# Altium schematic sheet Motors-Encoders.SchDoc
size A4; Organization: Memristor-Robotics; Address1: Vladimira Perića Valtera; Address2: Novi Sad, 21000; Address3: Serbia; SheetNumber: 9; SheetTotal: 11
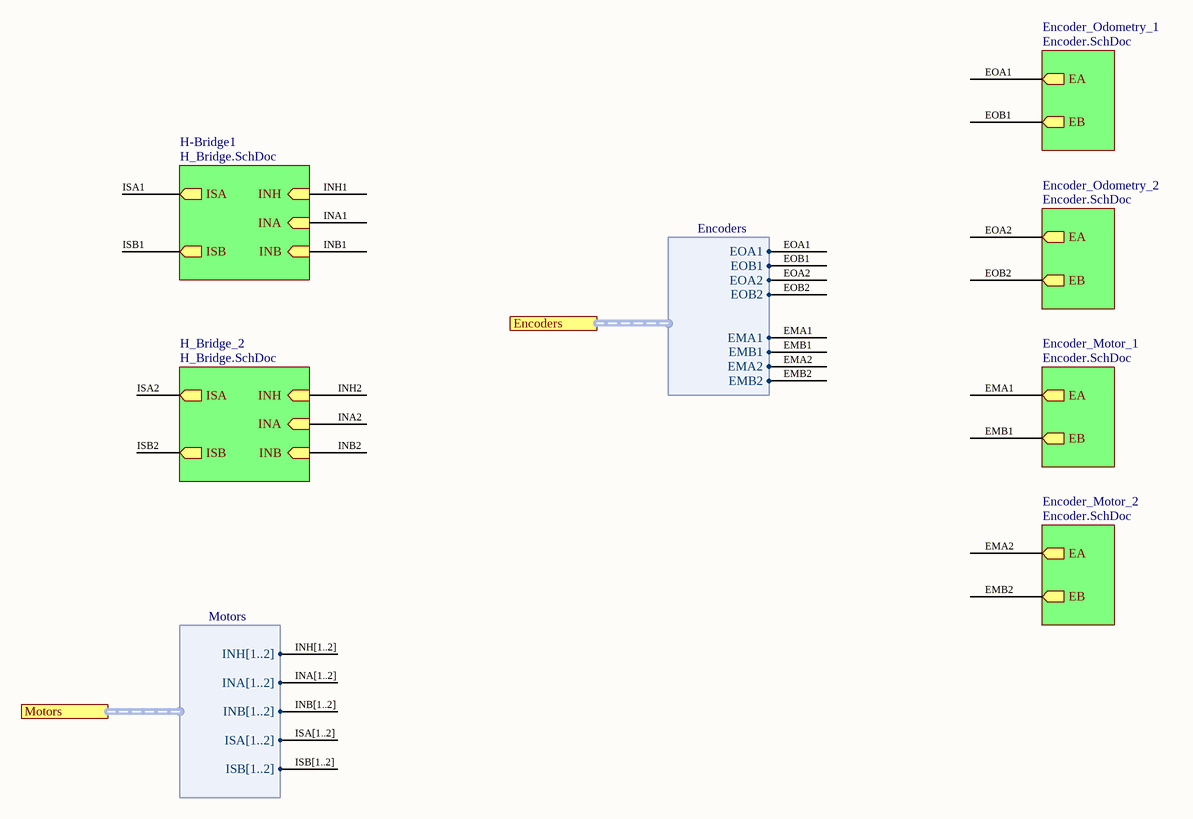
[diagram p0: Motors-Encoders.SchDoc]

## Sub-sheets
Encoder_Motor_1 = Encoder.SchDoc: EA (out), EB (out)
Encoder_Motor_2 = Encoder.SchDoc: EA (out), EB (out)
Encoder_Odometry_1 = Encoder.SchDoc: EA (out), EB (out)
Encoder_Odometry_2 = Encoder.SchDoc: EA (out), EB (out)
H-Bridge1 = H_Bridge.SchDoc: INH (in), INA (in), INB (in), ISA (out), ISB (out)
H_Bridge_2 = H_Bridge.SchDoc: INH (in), INA (in), INB (in), ISA (out), ISB (out)

## Ports
Encoders (harness Encoders), Motors (harness Motors)

## Harnesses
Encoders: EOA1, EOA2, EMA1, EMA2, EOB1, EOB2, EMB1, EMB2
Motors: INH[1..2], INB[1..2], ISB[1..2], INA[1..2], ISA[1..2]

## Nets
EMA1: sheet Encoder_Motor_1/EA, port Encoders.EMA1
EMA2: sheet Encoder_Motor_2/EA, port Encoders.EMA2
EMB1: sheet Encoder_Motor_1/EB, port Encoders.EMB1
EMB2: sheet Encoder_Motor_2/EB, port Encoders.EMB2
EOA1: sheet Encoder_Odometry_1/EA, port Encoders.EOA1
EOA2: sheet Encoder_Odometry_2/EA, port Encoders.EOA2
EOB1: sheet Encoder_Odometry_1/EB, port Encoders.EOB1
EOB2: sheet Encoder_Odometry_2/EB, port Encoders.EOB2
INA1: sheet H-Bridge1/INA
INA2: sheet H_Bridge_2/INA
INB1: sheet H-Bridge1/INB
INB2: sheet H_Bridge_2/INB
INH1: sheet H-Bridge1/INH
INH2: sheet H_Bridge_2/INH
ISA1: sheet H-Bridge1/ISA
ISA2: sheet H_Bridge_2/ISA
ISB1: sheet H-Bridge1/ISB
ISB2: sheet H_Bridge_2/ISB

## Buses and harness runs
bus INA[1..2]
bus INB[1..2]
bus INH[1..2]
bus ISA[1..2]
bus ISB[1..2]

## Notes on the sheet
- Title
- Date:
- Design Engineer:
- Time:
- Revision:
- Sheet
- of
- Size:
- A4
- www.memristor-robotics.io
- File: